# Altium project CAN_Tranceiver.PrjPcb
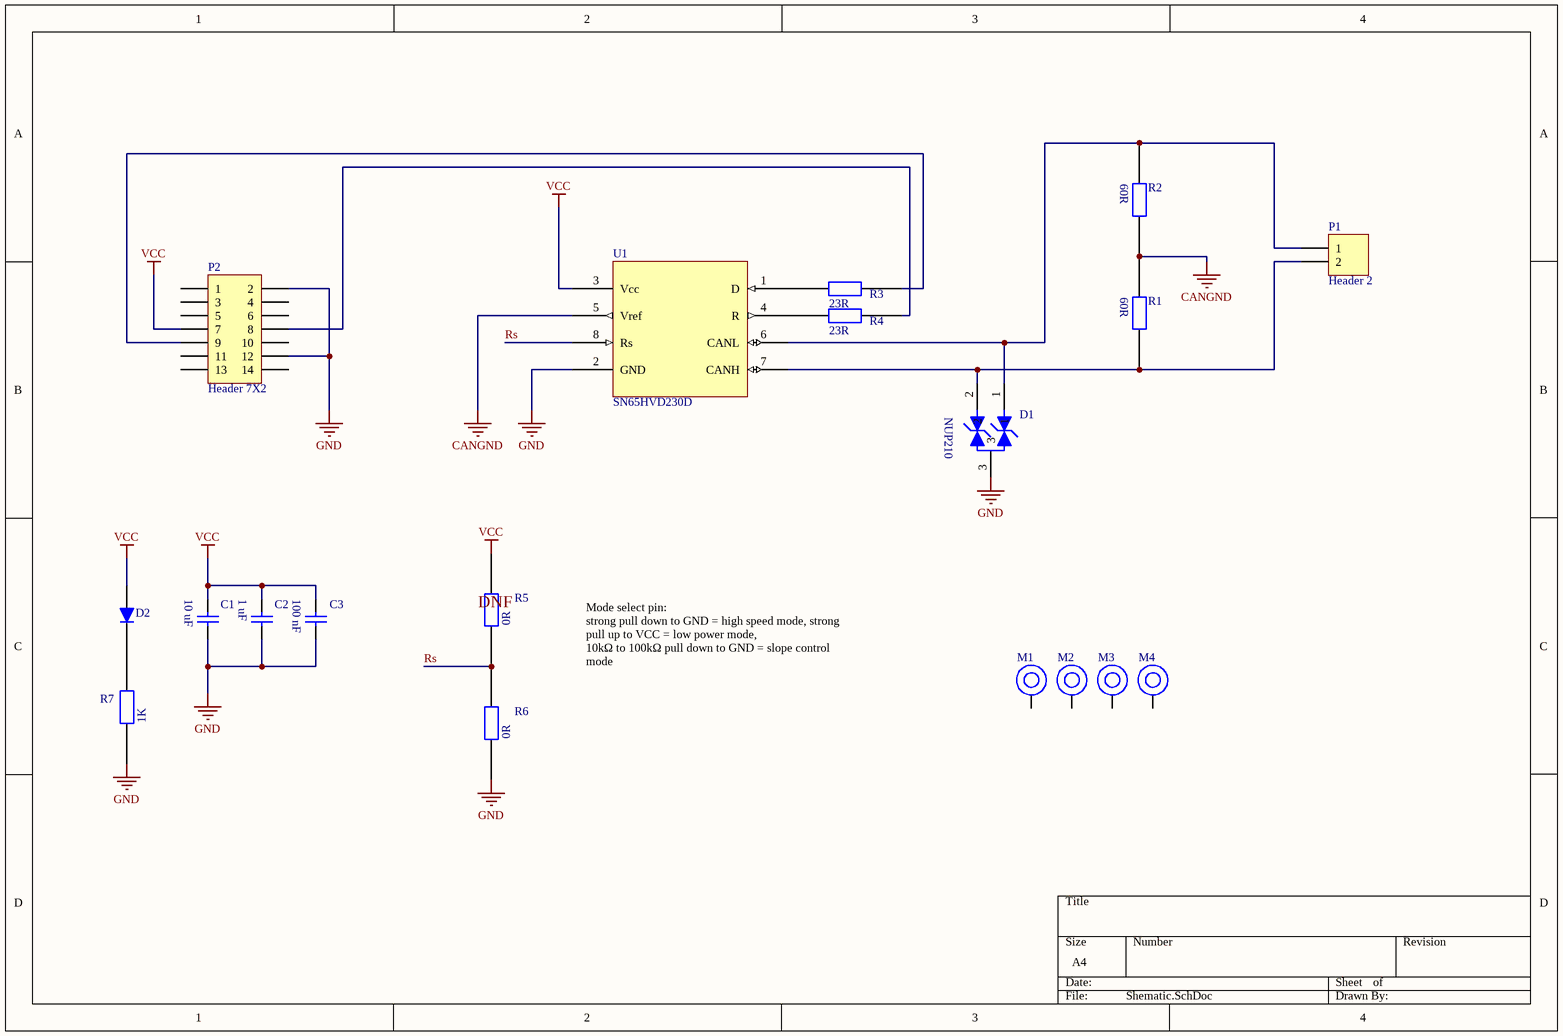
[diagram p0: Shematic.SchDoc]
1 sheet, 19 parts. Net scope: global (net labels, ports and power ports of the same name join across sheets).
Board file: PCB.PcbDoc

## Sheet Shematic.SchDoc: CAN Tranceiver
size A4; DrawnBy: Dale Matthews; Revision: V1I1; SheetNumber: 1; SheetTotal: 1

### Parts
C1  GRM21BR61A106KE19L  [CAPC2012]  (value not drawn)
C2  GCM188R71C105KA64D  [CAPC1608]  (value not drawn)
C3  GRJ188R71H104KE11D  [CAPC1608]  (value not drawn)
D1  SZNUP2105LT3G  [SOT23_A2A1K]  (value not drawn)
D2  LTST-C191KGKT  [LEDC1608M_AK]  (value not drawn)
M1  M  [MOUNTING]  (value not drawn)  (no BOM)
M2  M  [MOUNTING]  (value not drawn)  (no BOM)
M3  M  [MOUNTING]  (value not drawn)  (no BOM)
M4  M  [MOUNTING]  (value not drawn)  (no BOM)
P1  Header 2  [TERM_BLOCK_2_HORZ_RIACON01]
P2  Header 7X2  [IDC14-B]
R1  CR0603-FX-60R4ELF  [RESC1608]  (value not drawn)
R2  CR0603-FX-60R4ELF  [RESC1608]  (value not drawn)
R3  CR0603-FX-23R2ELF  [RESC1608]  (value not drawn)
R4  CR0603-FX-23R2ELF  [RESC1608]  (value not drawn)
R5  CR0603-J/-000ELF  [RESC1608]  (value not drawn)
R6  CR0603-J/-000ELF  [RESC1608]  (value not drawn)
R7  CR0603-FX-1001ELF  [RESC1608]  (value not drawn)
U1  SN65HVD230D  [SOIC127P580-8N]

### Nets
CANGND: R1.1 R2.2 U1.5(Vref)
GND: C1.2 C2.2 C3.2 D1.3 P2.2 P2.12 R6.1 R7.1 U1.2(GND)
VCC: C1.1 C2.1 C3.1 D2.A P2.7 R5.2 U1.3(Vcc)
Rs: R5.1 R6.2 U1.8(Rs)
NetD1_1: D1.1 P1.1 R2.1 U1.6(CANL)
NetD1_2: D1.2 P1.2 R1.2 U1.7(CANH)
NetD2_K: D2.K R7.2
NetP2_8: P2.8 R4.2
NetP2_9: P2.9 R3.2
NetR3_1: R3.1 U1.1(D)
NetR4_1: R4.1 U1.4(R)

Not connected (* = marked no-connect by the designer): M1 1; M2 1; M3 1; M4 1; P2 1 3 4 5 6 10 11 13 14

### Notes on the sheet
- (near R5) DNF
- Mode select pin:
  strong pull down to GND = high speed mode, strong pull up to VCC = low power mode,
  10kΩ to 100kΩ pull down to GND = slope control mode
- (in symbol CR0603-FX-23R2ELF) 23R
- (in symbol CR0603-FX-60R4ELF) 60R
- (in symbol CR0603-FX-1001ELF) 1K
- (in symbol CR0603-J/-000ELF) 0R
- (in symbol GRJ188R71H104KE11D) 100 nF
- (in symbol SZNUP2105LT3G) NUP210

### Library data of the parts
C1 = GRM21BR61A106KE19L: Multilayer Ceramic Capacitors MLCC - SMD/SMT 0805 10uF 10volts X5R 10%; Manufacturer: Murata Electronics; Type: General Purpose MLCC; Voltage Rating DC: 10 V; Supplier 1: Mouser; Manufacturer Part Number: GRM21BR61A106KE19L; RoHS: RoHS Compliant; Category: Multilayer Ceramic Capacitors MLCC - SMD/SMT; Stock 1: 213958; Pricing 1: 1=0.304, 10=0.133, 100=0.080, 1000=0.067, 3000=0.050, 9000=0.048, 24000=0.045, 45000=0.042, 99000=0.035 (AUD); Capacitance: 10 uF; Height: 1.25 mm; Length: 2 mm; Package / Case: 0805 (2012 metric); Packaging: Reel; Product: General Type MLCCs; Series: GRM; Termination Style: SMD/SMT; Tolerance: 10 %; Width: 1.25 mm; Brand: Murata Electronics; Case Code - in: 0805; Case Code - mm: 2012; Dielectric: X5R; Maximum Operating Temperature: + 85 C; Minimum Operating Temperature: - 55 C; Product Category: High Capacitance SMD Ceramic Chip Capacitors; Standard Pack Qty: 3000; RoHS - Mouser: Y; Minimum Order Quantity: 1; Reeling: True; ComponentLink1URL: http://www.mouser.com/ds/2/281/c02e-2905.pdf; ComponentLink1Description: http://www.mouser.com/ds/2/281/c02e-2905.pdf; Supplier Part Number 1: 81-GRM21BR61A106KE19
C2 = GCM188R71C105KA64D: Multilayer Ceramic Capacitors MLCC - SMD/SMT 0603 1.0uF 16volts X7R 10%; Manufacturer: Murata Electronics; Capacitance: 1 uF; Type: Automotive Ultra Small MLCC; Voltage Rating DC: 16 V; Supplier 1: Mouser; Manufacturer Part Number: GCM188R71C105KA64D; RoHS: RoHS Compliant; Category: Multilayer Ceramic Capacitors MLCC - SMD/SMT; Stock 1: 196143; Pricing 1: 1=0.432, 10=0.206, 100=0.122, 1000=0.114, 4000=0.080, 8000=0.077, 24000=0.074, 48000=0.069, 100000=0.061 (AUD); Height: 0.8 mm; Length: 1.6 mm; Package / Case: 0603 (1608 metric); Packaging: Reel; Product: Automotive MLCCs; Series: GCM; Termination Style: SMD/SMT; Tolerance: 10 %; Width: 0.8 mm; Brand: Murata Electronics; Case Code - in: 0603; Case Code - mm: 1608; Dielectric: X7R; Maximum Operating Temperature: + 125 C; Minimum Operating Temperature: - 55 C; Product Category: Automotive Ceramic Chip Capacitors; Standard Pack Qty: 4000; RoHS - Mouser: Y; Minimum Order Quantity: 1; Reeling: True; ComponentLink1URL: http://www.mouser.com/ds/2/281/c03e-516224.pdf; ComponentLink1Description: http://www.mouser.com/ds/2/281/c03e-516224.pdf; Supplier Part Number 1: 81-GCM188R71C105K64D
C3 = GRJ188R71H104KE11D: Multilayer Ceramic Capacitors MLCC - SMD/SMT 0603 0.10uF 50volts X7R +/-10% Soft Term; Manufacturer: Murata Electronics; Capacitance: 0.1 uF; Tolerance: 10 %; Type: Chip Monolithic Ceramic Capacitors; Voltage Rating DC: 50 V; Class: Class 2; Product Status: New Product; Supplier 1: Mouser; Manufacturer Part Number: GRJ188R71H104KE11D; RoHS: RoHS Compliant; Category: Multilayer Ceramic Capacitors MLCC - SMD/SMT; Stock 1: 12349; Pricing 1: 1=0.208, 10=0.085, 100=0.050, 1000=0.040, 4000=0.029, 8000=0.027, 48000=0.024, 100000=0.021 (AUD); Diameter: -; Height: 0.8 mm; Length: 1.6 mm; Package / Case: 0603 (1608 metric); Packaging: Reel; Product: General Type MLCCs; Series: GRJ; Termination Style: SMD/SMT; Width: 0.8 mm; Brand: Murata Electronics; Case Code - in: 0603; Case Code - mm: 1608; Dielectric: X7R; Maximum Operating Temperature: + 125 C; Minimum Operating Temperature: - 55 C; RoHS - Mouser: Y; Minimum Order Quantity: 1; Reeling: True; ComponentLink1URL: http://www.mouser.com/ds/2/281/c02e-2905.pdf; ComponentLink1Description: http://www.mouser.com/ds/2/281/c02e-2905.pdf; Supplier Part Number 1: 81-GRJ188R71H104KE1D
D1 = SZNUP2105LT3G: TVS DIODE 24VWM 44VC SOT23; Manufacturer: ON Semiconductor; Type: Zener; Bidirectional Channels: 2; Voltage - Reverse Standoff (Typ): 24V (Min); Voltage - Breakdown (Min): 26.2V; Voltage - Clamping (Max) @ Ipp: 44V; Current - Peak Pulse (10/1000µs): 8A (8/20µs); Power - Peak Pulse: 350W; Power Line Protection: No; Capacitance @ Frequency: 30pF @ 1MHz; Supplier 1: Digi-Key; Manufacturer Part Number: SZNUP2105LT3G; RoHS: RoHS Compliant; Category: Circuit Protection; Stock 1: 3956; Pricing 1: 1=0.58, 10=0.498, 100=0.3726, 500=0.2927, 1000=0.22564 (AUD); Packaging: Digi-Reel®; Unidirectional Channels: -; Applications: Automotive; Operating Temperature: -55°C ~ 150°C (TJ); Mounting Type: Surface Mount; Package / Case: TO-236-3, SC-59, SOT-23-3; Supplier Device Package: SOT-23-3 (TO-236); ComponentLink1URL: http://www.onsemi.com/pub_link/Collateral/NUP2105L-D.PDF; ComponentLink1Description: http://www.onsemi.com/pub_link/Collateral/NUP2105L-D.PDF; Supplier Part Number 1: SZNUP2105LT3GOSDKR-ND
D2 = LTST-C191KGKT: LED GREEN CLEAR 0603 SMD; Manufacturer: Lite-On Inc.; Wavelength - Dominant: 571nm; Wavelength - Peak: 574nm; Millicandela Rating: 35mcd; Voltage - Forward (Vf) (Typ): 2V; Current - Test: 20mA; Viewing Angle: 130°; Lens Color: Colorless; Lens Style/Size: Rectangle with Flat Top, 1.10mm x 0.80mm; Supplier 1: Digi-Key; Manufacturer Part Number: LTST-C191KGKT; RoHS: RoHS Compliant; Category: Optoelectronics; Stock 1: 654931; Pricing 1: 1=0.36, 10=0.284, 100=0.1549, 250=0.10328, 500=0.08778, 1000=0.06712, 2500=0.06067 (AUD); Packaging: Cut Tape (CT); Color: Green; Lens Transparency: Clear; Package / Case: 0603 (1608 Metric); Supplier Device Package: *; Size / Dimension: 1.60mm L x 0.80mm W; Height (Max): 0.55mm; Mounting Type: Surface Mount; ComponentLink1URL: http://optoelectronics.liteon.com/upload/download/DS22-2000-228/S_110_LTST-C191KGKT.pdf; ComponentLink1Description: http://optoelectronics.liteon.com/upload/download/DS22-2000-228/S_110_LTST-C191KGKT.pdf; Supplier Part Number 1: 160-1446-1-ND
M1-M4 = MOUNTING: MOUNTING HOLE - NON INSTALLABLE
P1 = Header 2: Header, 2-Pin; LatestRevisionDate: 17-Jul-2002; LatestRevisionNote: Re-released for DXP Platform.; Publisher: Altium Limited
P2 = Header 7X2: Header, 7-Pin, Dual row; LatestRevisionDate: 17-Jul-2002; LatestRevisionNote: Re-released for DXP Platform.; Publisher: Altium Limited
R1 R2 = CR0603-FX-60R4ELF: RES SMD 60.4 OHM 1% 1/10W 0603; Manufacturer: Bourns Inc.; Resistance (Ohms): 60.4; Power (Watts): 0.1W, 1/10W; Temperature Coefficient: ±100ppm/°C; Supplier 1: Digi-Key; Manufacturer Part Number: CR0603-FX-60R4ELF; RoHS: RoHS Compliant; Category: Resistors; Stock 1: 21305; Pricing 1: 1=0.14, 10=0.065, 25=0.0472, 50=0.036, 100=0.0266, 250=0.02024, 500=0.01618, 1000=0.01193, 2500=0.01035 (AUD); Packaging: Cut Tape (CT); Tolerance: ±1%; Composition: Thick Film; Features: Moisture Resistant; Operating Temperature: -55°C ~ 155°C; Package / Case: 0603 (1608 Metric); Supplier Device Package: 0603; Size / Dimension: 0.063" L x 0.031" W (1.60mm x 0.80mm); Height: 0.022" (0.55mm); Number of Terminations: 2; ComponentLink1URL: http://www.bourns.com/docs/Product-Datasheets/CHPREZTR.pdf; ComponentLink1Description: http://www.bourns.com/docs/Product-Datasheets/CHPREZTR.pdf; Supplier Part Number 1: CR0603-FX-60R4ELFCT-ND
R3 R4 = CR0603-FX-23R2ELF: RES SMD 23.2 OHM 1% 1/10W 0603; Manufacturer: Bourns Inc.; Resistance (Ohms): 23.2; Power (Watts): 0.1W, 1/10W; Temperature Coefficient: ±100ppm/°C; Supplier 1: Digi-Key; Manufacturer Part Number: CR0603-FX-23R2ELF; RoHS: RoHS Compliant; Category: Resistors; Stock 1: 0; Pricing 1: 25000=0.00659 (AUD); Packaging: Tape & Reel (TR); Tolerance: ±1%; Composition: Thick Film; Features: Moisture Resistant; Operating Temperature: -55°C ~ 155°C; Package / Case: 0603 (1608 Metric); Supplier Device Package: 0603; Size / Dimension: 0.063" L x 0.031" W (1.60mm x 0.80mm); Height: 0.022" (0.55mm); Number of Terminations: 2; ComponentLink1URL: http://www.bourns.com/docs/Product-Datasheets/CHPREZTR.pdf; ComponentLink1Description: http://www.bourns.com/docs/Product-Datasheets/CHPREZTR.pdf; Supplier Part Number 1: CR0603-FX-23R2ELF-ND
R5 R6 = CR0603-J/-000ELF: RES SMD 0.0OHM JUMPER 1/10W 0603; Manufacturer: Bourns Inc.; Resistance (Ohms): 0.0; Power (Watts): 0.1W, 1/10W; Supplier 1: Digi-Key; Manufacturer Part Number: CR0603-J/-000ELF; RoHS: RoHS Compliant; Category: Resistors; Stock 1: 187342; Pricing 1: 1=0.14, 10=0.041, 25=0.0296, 50=0.0224, 100=0.0166, 250=0.01268, 500=0.01012, 1000=0.00746, 2500=0.00647 (AUD); Packaging: Cut Tape (CT); Tolerance: Jumper; Composition: Thick Film; Features: Moisture Resistant; Temperature Coefficient: -; Operating Temperature: -55°C ~ 155°C; Package / Case: 0603 (1608 Metric); Supplier Device Package: 0603; Size / Dimension: 0.063" L x 0.031" W (1.60mm x 0.80mm); Height: 0.022" (0.55mm); Number of Terminations: 2; ComponentLink1URL: http://www.bourns.com/docs/Product-Datasheets/CHPREZTR.pdf; ComponentLink1Description: http://www.bourns.com/docs/Product-Datasheets/CHPREZTR.pdf; Supplier Part Number 1: CR0603-J/-000ELFCT-ND
R7 = CR0603-FX-1001ELF: RES SMD 1K OHM 1% 1/10W 0603; Manufacturer: Bourns Inc.; Power (Watts): 0.1W, 1/10W; Temperature Coefficient: ±100ppm/°C; Supplier 1: Digi-Key; Manufacturer Part Number: CR0603-FX-1001ELF; RoHS: RoHS Compliant; Category: Resistors; Stock 1: 28425; Pricing 1: 1=0.14, 10=0.065, 25=0.0472, 50=0.036, 100=0.0266, 250=0.02024, 500=0.01618, 1000=0.01193, 2500=0.01035 (AUD); Packaging: Digi-Reel®; Resistance (Ohms): 1k; Tolerance: ±1%; Composition: Thick Film; Features: Moisture Resistant; Operating Temperature: -55°C ~ 155°C; Package / Case: 0603 (1608 Metric); Supplier Device Package: 0603; Size / Dimension: 0.063" L x 0.031" W (1.60mm x 0.80mm); Height: 0.022" (0.55mm); Number of Terminations: 2; ComponentLink1URL: http://www.bourns.com/docs/Product-Datasheets/CHPREZTR.pdf; ComponentLink1Description: http://www.bourns.com/docs/Product-Datasheets/CHPREZTR.pdf; Supplier Part Number 1: CR0603-FX-1001ELFDKR-ND
U1 = SN65HVD230D: IC CAN TRANSCEIVER 3.3V 8-SOIC; Manufacturer: Texas Instruments; Number of Drivers/Receivers: 1/1; Duplex: Half; Receiver Hysteresis: 100mV; Data Rate: 1Mbps; Voltage - Supply: 3 V ~ 3.6 V; Supplier 1: Digi-Key; Manufacturer Part Number: SN65HVD230D; RoHS: RoHS Compliant; Category: Integrated Circuits (ICs); Stock 1: 2539; Pricing 1: 1=4.08, 10=3.678, 25=3.1952, 50=2.9962, 100=2.9536, 250=2.627, 500=2.2294, 750=2.0164, 1000=1.5975 (AUD); Packaging: Tube; Type: Transceiver; Protocol: CAN; Operating Temperature: -40°C ~ 85°C; Mounting Type: Surface Mount; Package / Case: 8-SOIC (0.154", 3.90mm Width); Supplier Device Package: 8-SOIC; ComponentLink1URL: http://www.ti.com/lit/ds/symlink/sn65hvd230.pdf; ComponentLink1Description: http://www.ti.com/lit/ds/symlink/sn65hvd230.pdf; Supplier Part Number 1: SN65HVD230D-ND